# EAGLE design fonteechaveador2 (EAGLE 7.5.0)
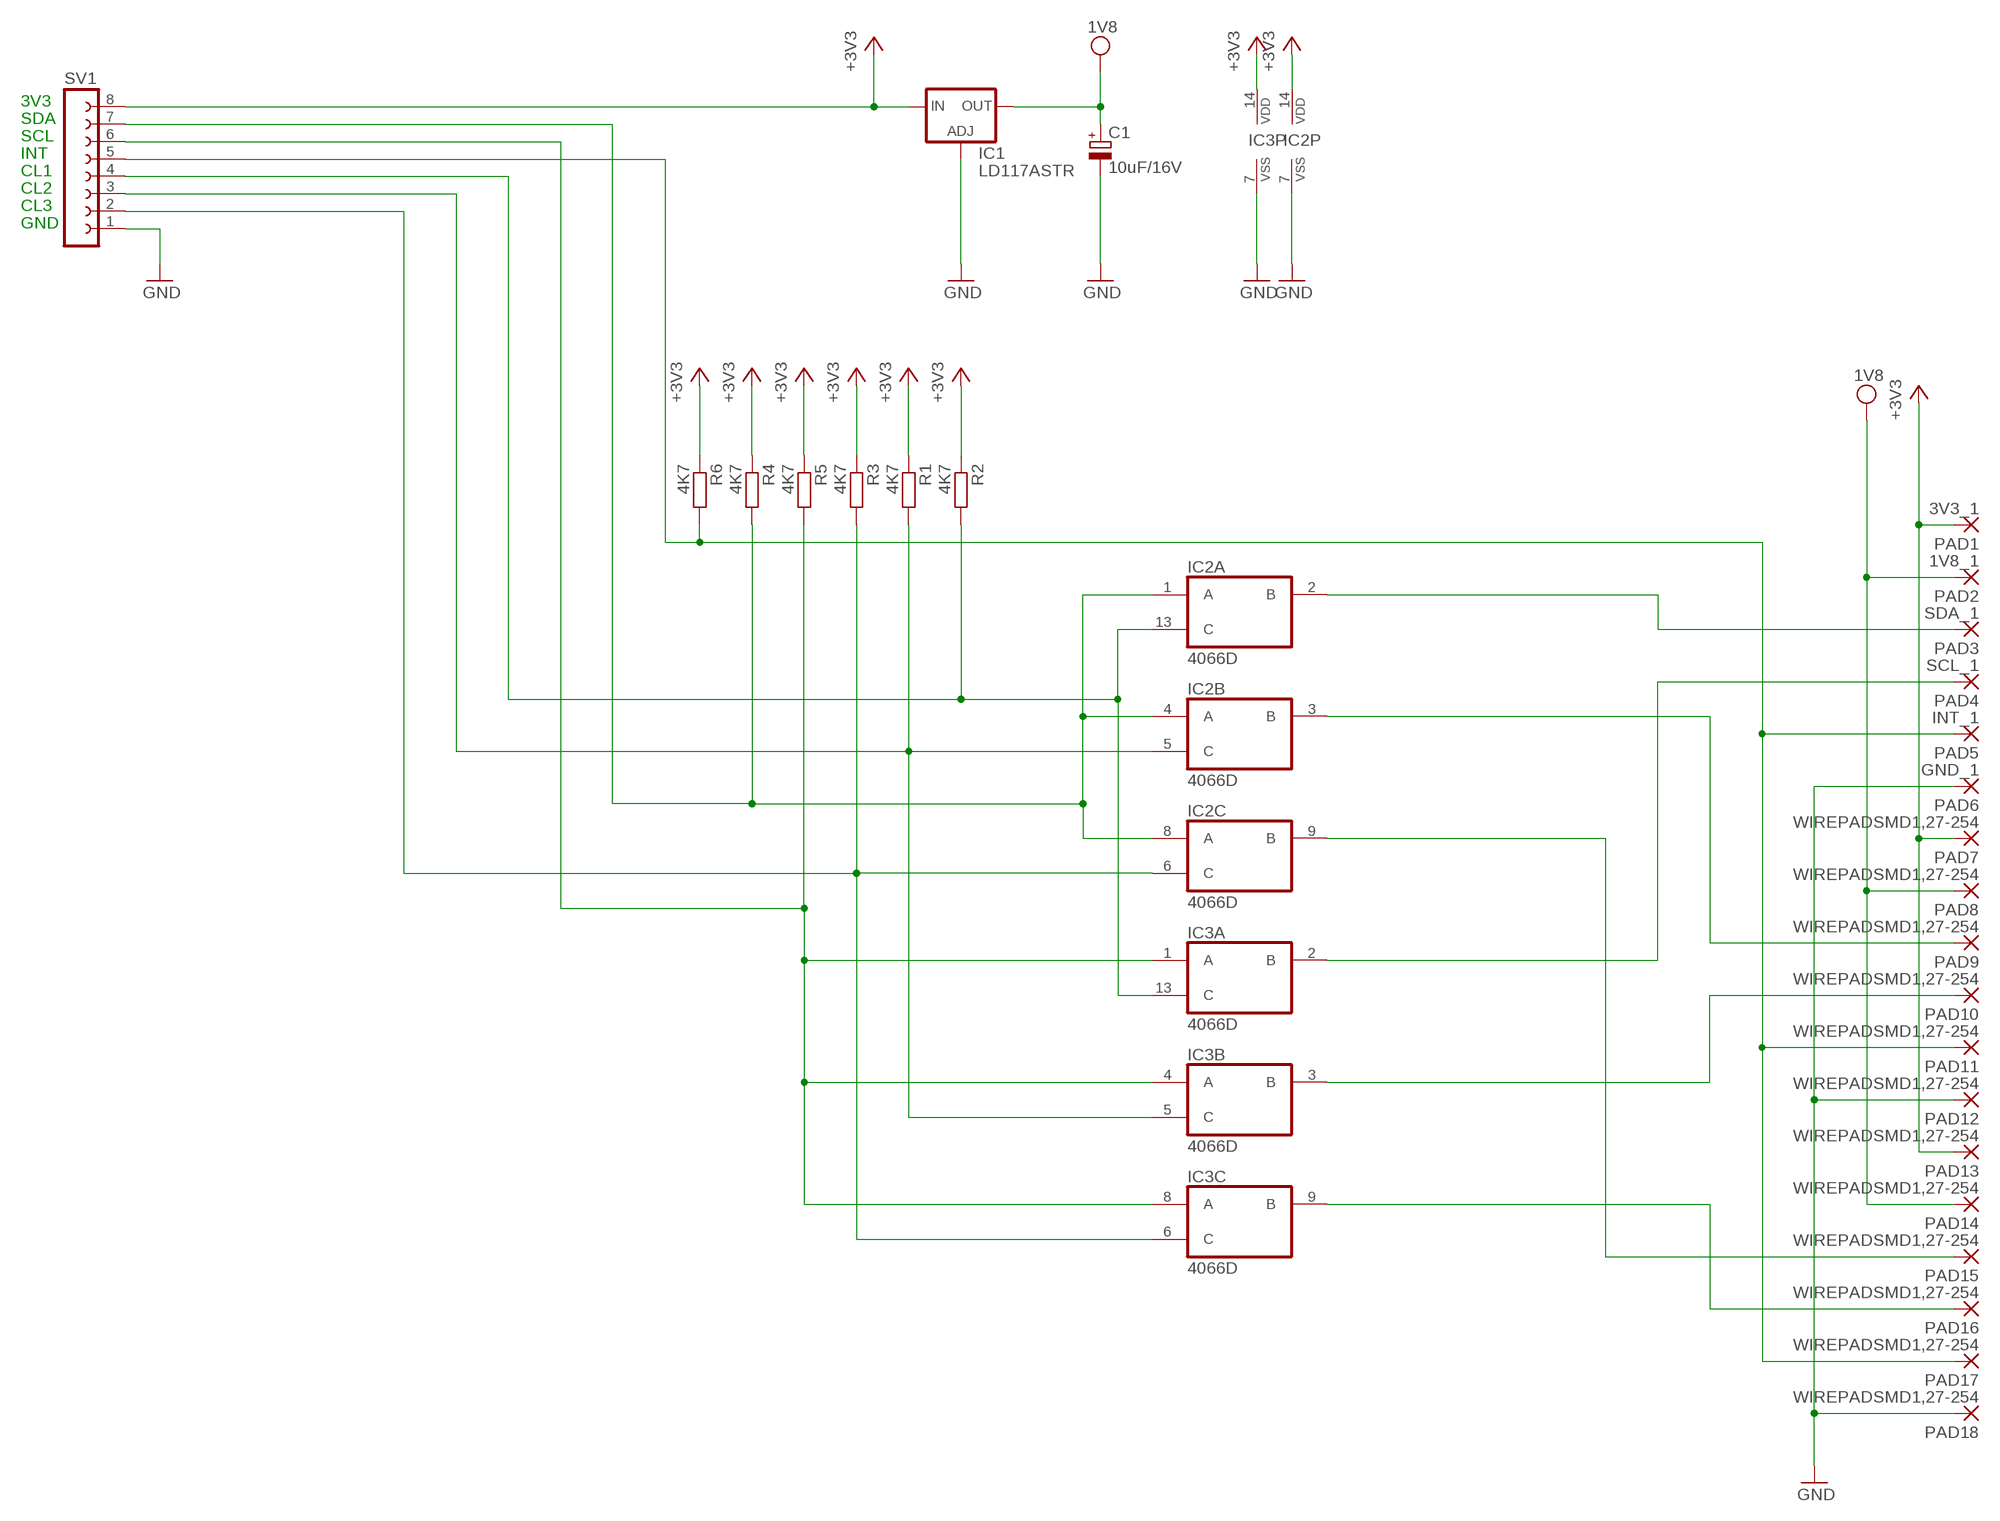
[diagram p0: schematic, sheet 1]

## Parts
C1  10uF/16V  CPOL-EU140CLH-0810  [140CLH-0810]
IC1  LD117ASTR  [SOT223]
IC2  4066D  [SO14]
IC3  4066D  [SO14]
PAD1  3V3_1  WIREPADSMD1,27-254  [SMD1,27-2,54]
PAD2  1V8_1  WIREPADSMD1,27-254  [SMD1,27-2,54]
PAD3  SDA_1  WIREPADSMD1,27-254  [SMD1,27-2,54]
PAD4  SCL_1  WIREPADSMD1,27-254  [SMD1,27-2,54]
PAD5  INT_1  WIREPADSMD1,27-254  [SMD1,27-2,54]
PAD6  GND_1  WIREPADSMD1,27-254  [SMD1,27-2,54]
PAD7  WIREPADSMD1,27-254  [SMD1,27-2,54]
PAD8  WIREPADSMD1,27-254  [SMD1,27-2,54]
PAD9  WIREPADSMD1,27-254  [SMD1,27-2,54]
PAD10  WIREPADSMD1,27-254  [SMD1,27-2,54]
PAD11  WIREPADSMD1,27-254  [SMD1,27-2,54]
PAD12  WIREPADSMD1,27-254  [SMD1,27-2,54]
PAD13  WIREPADSMD1,27-254  [SMD1,27-2,54]
PAD14  WIREPADSMD1,27-254  [SMD1,27-2,54]
PAD15  WIREPADSMD1,27-254  [SMD1,27-2,54]
PAD16  WIREPADSMD1,27-254  [SMD1,27-2,54]
PAD17  WIREPADSMD1,27-254  [SMD1,27-2,54]
PAD18  WIREPADSMD1,27-254  [SMD1,27-2,54]
R1  4K7  R-EU_M0805  [M0805]
R2  4K7  R-EU_M0805  [M0805]
R3  4K7  R-EU_M0805  [M0805]
R4  4K7  R-EU_M0805  [M0805]
R5  4K7  R-EU_M0805  [M0805]
R6  4K7  R-EU_M0805  [M0805]
SV1  FE08-1  [FE08]

## Nets
+3V3: IC1.3(IN) IC2.14(P:VDD) IC3.14(P:VDD) PAD1.1(P) PAD7.1(P) PAD13.1(P) R1.1 R2.1 R3.1 R4.1 R5.1 R6.1 SV1.8
GND: C1.- IC1.1(ADJ) IC2.7(P:VSS) IC3.7(P:VSS) PAD6.1(P) PAD12.1(P) PAD18.1(P) SV1.1
N$1: IC2.13(A:C) IC3.13(A:C) R2.2 SV1.4
N$2: IC2.5(B:C) IC3.5(B:C) R1.2 SV1.3
N$4: IC2.1(A:A) IC2.4(B:A) IC2.8(C:A) R4.2 SV1.7
N$5: IC3.1(A:A) IC3.4(B:A) IC3.8(C:A) R5.2 SV1.6
N$6: PAD5.1(P) PAD11.1(P) PAD17.1(P) R6.2 SV1.5
N$7: IC2.2(A:B) PAD3.1(P)
N$8: IC2.3(B:B) PAD9.1(P)
N$9: IC2.9(C:B) PAD15.1(P)
N$10: IC3.2(A:B) PAD4.1(P)
N$11: IC3.3(B:B) PAD10.1(P)
N$12: IC3.9(C:B) PAD16.1(P)
N$13: IC2.6(C:C) IC3.6(C:C) R3.2 SV1.2
VDD: C1.+ IC1.4(OUT) PAD2.1(P) PAD8.1(P) PAD14.1(P) ; supply symbol labelled 1V8
Unconnected: IC2.10(D:B) IC2.11(D:A) IC2.12(D:C) IC3.10(D:B) IC3.11(D:A) IC3.12(D:C)

## Notes on the sheet
- 3V3
- SDA
- SCL
- INT
- CL1
- CL2
- CL3
- GND

## Library data of the parts
C1 = resistor:CPOL-EU: POLARIZED CAPACITOR, European symbol
IC1 = v-reg:LD117A?*: Low drop fixed and adjustable positive voltage regulators 1 A Source: http://www.st.com/stonline/products/literature/ds/7194/ld1117axx.pdf
IC2 IC3 = 40xx:4066: Quad bilateral ANALOG SWITCH
PAD1-PAD18 = wirepad:WIREPAD: Wire PAD connect wire on PCB
R1-R6 = resistor:R-EU_: RESISTOR, European symbol
SV1 = con-lsta:FE08-1: FEMALE HEADER; OC_FARNELL: unknown; OC_NEWARK: unknown

## Board
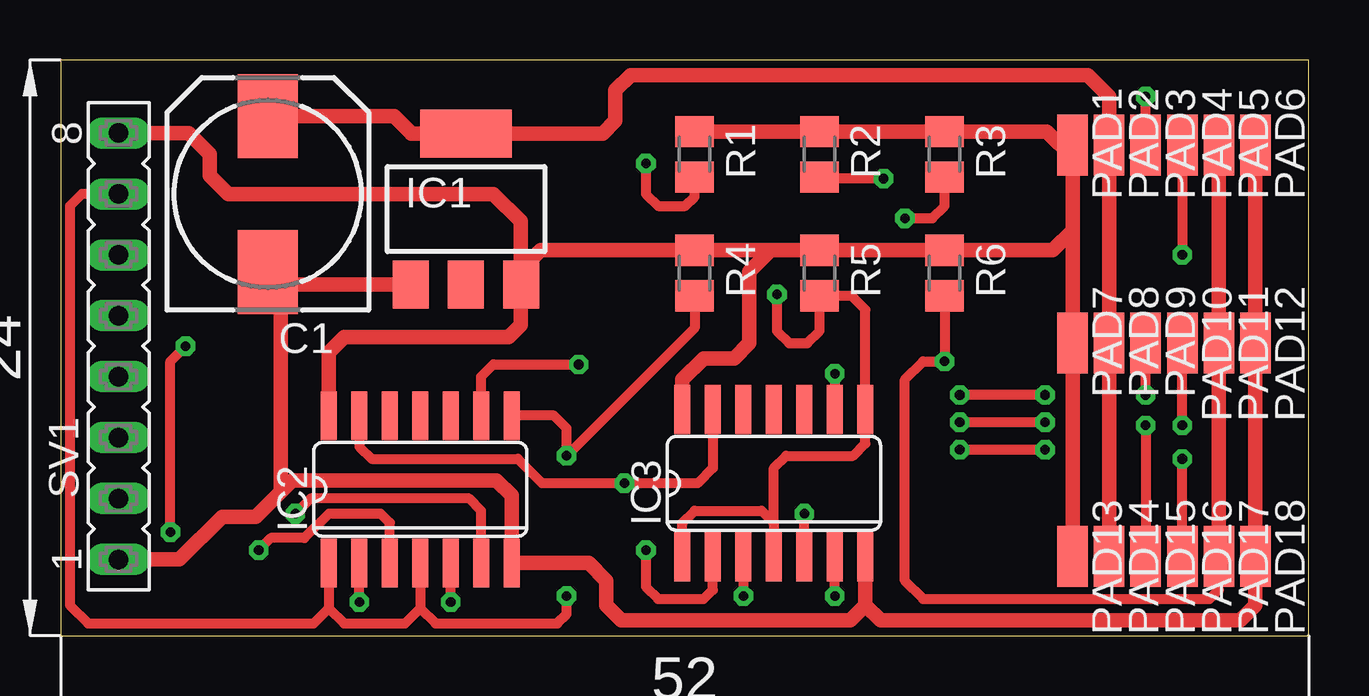
[diagram p1: board, top side]
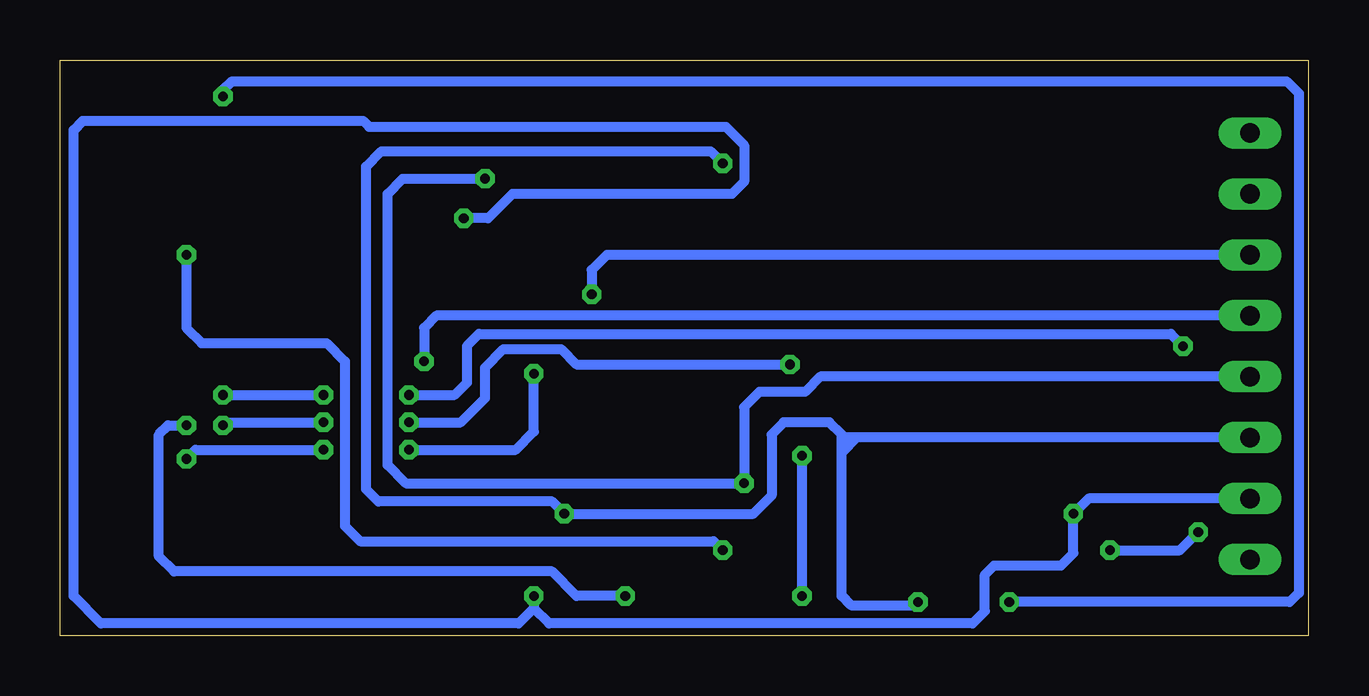
[diagram p2: board, bottom side, seen from below]

Size 52 x 24 mm. Coordinates in mm from the lower left corner, seen from the top.
Outline: 0,0 52,0 52,24 0,24 0,0
Copper layers (1*16): Top 0.035mm / dielectric 1.5mm / Bottom 0.035mm
Design rules "default *": minimum track width 10mil, minimum drill 24mil, track to track 8mil, track to pad 8mil, pad to pad 8mil, via to via 8mil, smd to smd 8mil, copper to edge 3mil, drill to drill 5mil, minimum pad ring 10mil, minimum via ring 8mil, stop-mask expansion 4mil, vias tented up to drill 0mil, thermal gap 10mil

### Footprints (pad centres in the part's own frame; a part is rotated, then mirrored left to right if it is on the bottom)
140CLH-0810 = smd 3.5 x 2.5: + 3.25,0; - -3.25,0
SOT223 = smd 1.5 x 2: 1 -2.3,-3.15; 2 0,-3.15; 3 2.3,-3.15 | smd 3.8 x 2: 4 0,3.15
SO14 = smd 0.66 x 2.032: 1 -3.81,-3.073; 2 -2.54,-3.073; 3 -1.27,-3.073; 4 0,-3.073; 5 1.27,-3.073; 6 2.54,-3.073; 7 3.81,-3.073; 8 3.81,3.073; 9 2.54,3.073; 10 1.27,3.073; 11 0,3.073; 12 -1.27,3.073; 13 -2.54,3.073; 14 -3.81,3.073
SMD1,27-2,54 = smd 1.27 x 2.54: 1 0,0
M0805 = smd 1.3 x 1.6: 1 -0.95,0; 2 0.95,0
FE08 = drill 0.813 long: 1 -8.89,0; 2 -6.35,0; 3 -3.81,0; 4 -1.27,0; 5 1.27,0; 6 3.81,0; 7 6.35,0; 8 8.89,0

### Placement (x,y rotation side)
C1  8.64,18.41 90 top
IC1  16.89,17.78 0 top
IC2  14.99,6.1 0 top
IC3  29.72,6.35 0 top
PAD1  42.16,20.45 180 top
PAD2  43.69,20.45 180 top
PAD3  45.21,20.45 180 top
PAD4  46.74,20.45 180 top
PAD5  48.26,20.45 180 top
PAD6  49.78,20.45 180 top
PAD7  42.16,12.19 180 top
PAD8  43.69,12.19 180 top
PAD9  45.21,12.19 180 top
PAD10  46.74,12.19 180 top
PAD11  48.26,12.19 180 top
PAD12  49.78,12.19 180 top
PAD13  42.16,3.3 180 top
PAD14  43.69,3.3 180 top
PAD15  45.21,3.3 180 top
PAD16  46.74,3.3 180 top
PAD17  48.26,3.3 180 top
PAD18  49.78,3.3 180 top
R1  26.42,20.07 270 top
R2  31.62,20.07 270 top
R3  36.83,20.07 270 top
R4  26.42,15.11 270 top
R5  31.62,15.11 270 top
R6  36.83,15.11 270 top
SV1  2.41,12.06 90 top

### Tracks (layer width: path | path; a pad name or v marks a point on that pad's centre or on a via)
+3V3
  Top 0.61: PAD13.1 PAD7.1 42.16,16.89 | 42.16,16.89 42.16,19.94 | 42.16,19.94 PAD1.1 | SV1.8 5.33,20.95 6.22,20.07 6.22,19.18 6.99,18.41 18.03,18.41 19.18,17.27 19.18,15.24 | 19.18,15.24 19.18,14.64 IC1.3 19.18,12.95 18.67,12.45 11.81,12.45 11.18,11.81 IC2.14 | 19.18,15.24 20,16.06 R4.1 29.59,16.06 | 29.59,16.06 R5.1 R6.1 41.34,16.06 42.16,16.89 | R1.1 R2.1 R3.1 41.09,21.02 42.16,19.94 | IC3.14 25.91,10.67 26.8,11.56 28.07,11.56 28.7,12.19 28.7,15.17 29.59,16.06
GND
  Top 0.61: PAD6.1 PAD12.1 PAD18.1 49.78,1.27 49.15,0.64 34.16,0.64 33.53,1.27 | IC1.1 9.17,14.63 | 9.17,14.63 C1.- | SV1.1 4.95,3.17 6.73,4.95 8.13,4.95 9.17,6 | 9.17,14.63 9.17,6 | IC3.7 33.53,1.27 | 33.53,1.27 32.89,0.64 23.37,0.64 22.73,1.27 22.73,2.29 22,3.02 IC2.7 18.8,5.84 18.16,6.48 9.65,6.48 9.17,6
N$1  (via drill 0.4)
  Top 0.406: v34.29,19.05 31.69,19.05 R2.2 | IC2.13 12.45,7.87 12.95,7.37 19.05,7.37 20.07,6.35 v23.5,6.35 26.54,6.35 27.18,6.99 IC3.13
  Bottom 0.406: v34.29,19.05 37.72,19.05 38.35,18.41 38.35,7.11 37.59,6.35 v23.5,6.35 23.5,9.53 22.86,10.16 20.95,10.16 20.32,10.79 SV1.4
N$2  (via drill 0.4)
  Top 0.406: v24.38,19.68 24.38,18.41 24.89,17.91 26.04,17.91 26.42,18.29 R1.2 | IC3.5 v30.99,5.08 | v16.26,1.4 IC2.5
  Bottom 0.406: 19.43,7.62 19.43,1.65 19.05,1.27 16.38,1.27 v16.26,1.4 | 19.43,7.62 19.43,8.38 | 19.43,8.38 19.94,8.89 21.84,8.89 22.35,8.38 22.35,5.84 23.11,5.08 v30.99,5.08 31.5,5.59 38.73,5.59 39.24,6.1 39.24,19.56 38.61,20.19 24.89,20.19 v24.38,19.68 | 18.8,8.26 19.43,7.62 | SV1.3 19.3,8.26 19.43,8.38
N$4  (via drill 0.4)
  Top 0.406: SV1.7 0.89,18.41 0.38,17.91 0.38,1.27 1.14,0.51 10.54,0.51 11.18,1.14 | IC2.1 11.18,1.14 | 11.18,1.14 11.81,0.51 14.35,0.51 14.99,1.14 | IC2.4 14.99,1.14 | 14.99,1.14 15.62,0.51 20.7,0.51 21.08,0.89 v21.08,1.65 | IC2.8 20.55,9.17 21.08,8.64 v21.08,7.49 26.42,12.83 R4.2
  Bottom 0.406: v21.08,1.65 v21.08,7.49
N$5  (via drill 0.4)
  Top 0.406: IC3.1 25.91,4.7 26.42,5.21 29.21,5.21 29.72,4.7 | 29.72,4.7 IC3.4 | v29.84,14.22 29.84,12.7 30.35,12.19 31.11,12.19 31.62,12.7 R5.2 32.95,14.16 33.53,13.59 IC3.8 33.53,8 33.02,7.49 30.23,7.49 29.72,6.99 29.72,4.7
  Bottom 0.406: SV1.6 29.21,15.88 29.84,15.24 v29.84,14.22
N$6  (via drill 0.4)
  Top 0.406: R6.2 v36.83,11.43 35.94,11.43 35.18,10.67 35.18,2.29 35.94,1.52 47.88,1.52 48.26,1.91 PAD17.1
  Top 0.61: PAD5.1 PAD11.1 PAD17.1
  Bottom 0.406: SV1.5 36.32,13.34 36.83,12.83 v36.83,11.43
N$7  (via drill 0.4)
  Top 0.406: PAD3.1 v45.21,22.48 | v12.45,1.4 IC2.2
  Bottom 0.406: v45.21,22.48 45.21,22.73 44.83,23.11 0.89,23.11 0.38,22.61 0.38,1.78 0.76,1.4 v12.45,1.4
N$8  (via drill 0.4)
  Top 0.406: IC2.3 13.72,4.7 13.34,5.08 11.18,5.08 10.16,4.06 8.76,4.06 v8.26,3.56 | v4.57,4.32 4.57,11.43 v5.21,12.06 | v41.02,10.03 v37.47,10.03 | v45.21,10.03 PAD9.1
  Bottom 0.406: v8.26,3.56 5.33,3.56 v4.57,4.32 | v45.21,10.03 v41.02,10.03 | v37.47,10.03 35.56,10.03 35.05,10.54 35.05,12.06 34.54,12.57 5.71,12.57 v5.21,12.06
N$9  (via drill 0.4)
  Top 0.406: IC2.9 17.53,10.79 18.03,11.3 v21.59,11.3 | v45.21,8.76 PAD15.1 | v41.02,8.89 v37.47,8.89
  Bottom 0.406: v21.59,11.3 30.48,11.3 31.11,11.94 33.53,11.94 34.29,11.18 34.29,9.91 35.31,8.89 v37.47,8.89 | v45.21,8.76 45.09,8.89 v41.02,8.89
N$10  (via drill 0.4)
  Top 0.406: PAD4.1 v46.74,15.88 | v24.38,3.56 24.38,2.03 24.89,1.52 26.8,1.52 27.18,1.91 IC3.2
  Bottom 0.406: v46.74,15.88 46.74,12.83 46.1,12.19 40.89,12.19 40.13,11.43 40.13,4.57 39.5,3.94 24.77,3.94 v24.38,3.56
N$11  (via drill 0.4)
  Top 0.406: IC3.3 v28.45,1.65 | v46.74,8.76 PAD10.1
  Bottom 0.406: v28.45,1.65 30.48,1.65 31.5,2.67 47.24,2.67 47.88,3.3 47.88,8.38 47.5,8.76 v46.74,8.76
N$12  (via drill 0.4)
  Top 0.406: PAD16.1 v46.74,7.37 | v41.02,7.75 v37.47,7.75 | v32.26,10.92 IC3.9
  Bottom 0.406: v46.74,7.37 46.35,7.75 v41.02,7.75 | v37.47,7.75 33.02,7.75 32.26,8.51 v32.26,10.92
N$13  (via drill 0.4)
  Top 0.406: v32.26,1.65 IC3.6 | v35.18,17.4 36.32,17.4 36.83,17.91 R3.2 | IC2.6 17.53,5.21 17.02,5.71 10.41,5.71 v9.78,5.08
  Bottom 0.406: 32.26,1.14 31.62,0.51 13.97,0.51 13.46,1.02 13.46,2.54 13.08,2.92 10.29,2.92 9.78,3.43 v9.78,5.08 9.14,5.71 SV1.2 | v35.18,17.4 34.16,17.4 33.15,18.41 24,18.41 23.5,18.92 23.5,20.45 24.26,21.21 39.12,21.21 39.37,21.46 51.05,21.46 51.44,21.08 51.44,1.65 50.29,0.51 32.89,0.51 32.26,1.14 | v32.26,1.65 32.26,1.14
VDD
  Top 0.61: PAD14.1 PAD8.1 PAD2.1 43.69,22.48 42.8,23.37 23.75,23.37 23.11,22.73 23.11,21.46 22.58,20.93 IC1.4 14.61,20.93 14.61,20.95 13.89,21.66 C1.+